# EAGLE design heart (EAGLE 9.6.2)
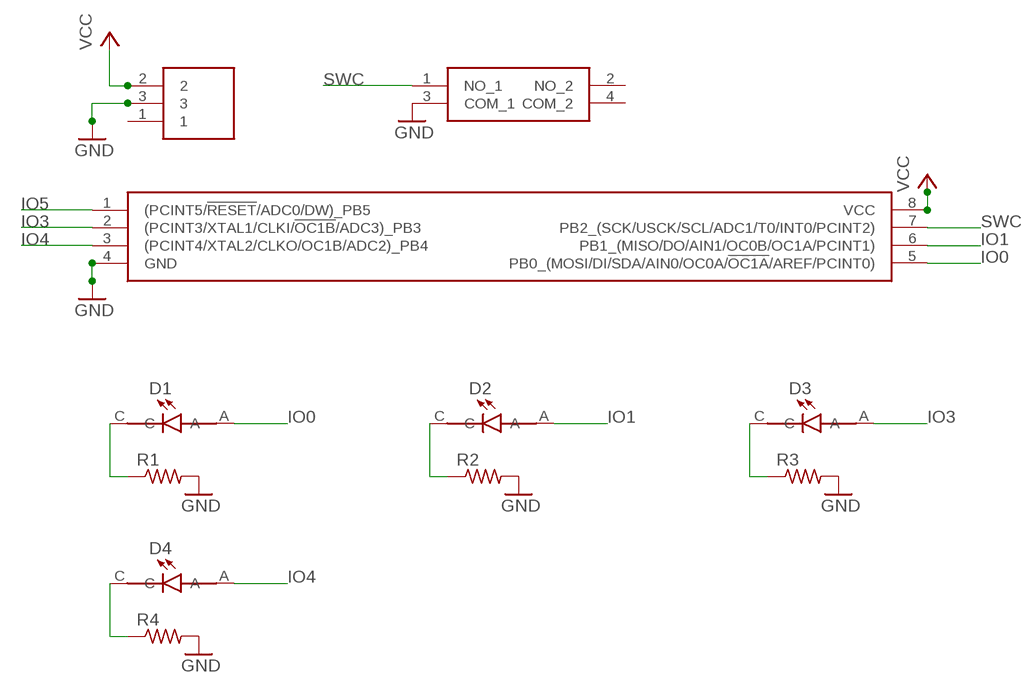
[diagram p0: schematic, sheet 1]

## Parts
D1  SML-LXT0805IW-TR  [LEDC2012X120N]
D2  SML-LXT0805IW-TR  [LEDC2012X120N]
D3  SML-LXT0805IW-TR  [LEDC2012X120N]
D4  SML-LXT0805IW-TR  [LEDC2012X120N]
IC1  ATTINY85-20SU  [SOIC127P798X216-8N]
R1  R-US_R0805  [R0805]
R2  R-US_R0805  [R0805]
R3  R-US_R0805  [R0805]
R4  R-US_R0805  [R0805]
S1  TS18-5-20-SL-160-SMT-TR  [TS18520SL160SMTTR]
U1  BAT-HLD-001  [BATHLD001]

## Nets
GND: IC1.4(GND) R1.2 R2.2 R3.2 R4.2 S1.3(COM_1) U1.3
IO0: D1.A IC1.5(PB0_(MOSI/DI/SDA/AIN0/OC0A/!OC1A!/AREF/PCINT0))
IO1: D2.A IC1.6(PB1_(MISO/DO/AIN1/OC0B/OC1A/PCINT1))
IO3: D3.A IC1.2((PCINT3/XTAL1/CLKI/!OC1B!/ADC3)_PB3)
IO4: D4.A IC1.3((PCINT4/XTAL2/CLKO/OC1B/ADC2)_PB4)
IO5: IC1.1((PCINT5/!RESET!/ADC0/DW)_PB5)
N$1: D1.C R1.1
N$2: D4.C R4.1
N$3: D2.C R2.1
N$5: D3.C R3.1
SWC: IC1.7(PB2_(SCK/USCK/SCL/ADC1/T0/INT0/PCINT2)) S1.1(NO_1)
VCC: IC1.8(VCC) U1.2
Unconnected: S1.2(NO_2) S1.4(COM_2) U1.1

## Library data of the parts
D1-D4 = SML-LXT0805IW-TR:SML-LXT0805IW-TR: LED; Luminous Intensity:11µcd; Viewing Angle:140°; Forward Current:30mA; Forward Voltage:2V; Color:Red; LED Color:Red; Leaded Process Compatible:Yes; Lens Color:White; Mounting Type:Surface Mount ;RoHS Compliant: Yes Check availability <https://pricing.snapeda.com/parts/SML-LXT0805IW-TR/Lumex%20Opto/Components/view-part?ref=eda>; AVAILABILITY: In Stock; DESCRIPTION: Red - LED Indication - Discrete 2V 0805 (2012 Metric); MF: Lumex Opto/Components; MP: SML-LXT0805IW-TR; PACKAGE: 0805 Lumex; PRICE: None; PURCHASE-URL: https://pricing.snapeda.com/search/part/SML-LXT0805IW-TR/?ref=eda
IC1 = ATTINY85-20SU:ATTINY85-20SU: MICROCHIP - ATTINY85-20SU - MICROCONTROLLER MCU, 8 BIT, ATTINY, 20MHZ, SOIC-8 Source: Datasheet <https://componentsearchengine.com/Datasheets/2/ATTINY85-20SU.pdf>; DESCRIPTION: MICROCHIP - ATTINY85-20SU - MICROCONTROLLER MCU, 8 BIT, ATTINY, 20MHZ, SOIC-8; HEIGHT: 2.16mm; MANUFACTURER_NAME: Microchip; MANUFACTURER_PART_NUMBER: ATTINY85-20SU; MOUSER_PART_NUMBER: 556-ATTINY85-20SU; MOUSER_PRICE-STOCK: https://www.mouser.co.uk/ProductDetail/Microchip-Technology-Atmel/ATTINY85-20SU?qs=8jWQYweyg6N%2FGXnwAe4Icw%3D%3D
R1-R4 = adafruit:R-US_: RESISTOR, American symbol
S1 = TS18-5-20-SL-160-SMT-TR:TS18-5-20-SL-160-SMT-TR: Tactile Switches 5 x 5 mm, 2 mm Actuator Height, 160 gf, Silver, Surface Mount, TR, SPST, Tactile Switch Source: Datasheet <https://www.cuidevices.com/product/resource/ts18.pdf>; DESCRIPTION: Tactile Switches 5 x 5 mm, 2 mm Actuator Height, 160 gf, Silver, Surface Mount, TR, SPST, Tactile Switch; HEIGHT: 2.2mm; MANUFACTURER_NAME: CUI Devices; MANUFACTURER_PART_NUMBER: TS18-5-20-SL-160-SMT-TR; MOUSER_PART_NUMBER: 179-TS18520SL160SMTT; MOUSER_PRICE-STOCK: https://www.mouser.co.uk/ProductDetail/CUI-Devices/TS18-5-20-SL-160-SMT-TR?qs=tlsG%2FOw5FFjSVAS9XMKu7w%3D%3D
U1 = BAT-HLD-001:BAT-HLD-001: Coin Cell Battery Holders Linx CR2032 Battery Holder Source: Datasheet; DESCRIPTION: Coin Cell Battery Holders Linx CR2032 Battery Holder; HEIGHT: 4mm; MANUFACTURER_NAME: Linx Technologies; MANUFACTURER_PART_NUMBER: BAT-HLD-001; MOUSER_PART_NUMBER: 712-BAT-HLD-001; MOUSER_PRICE-STOCK: https://www.mouser.co.uk/ProductDetail/Linx-Technologies/BAT-HLD-001?qs=K5ta8V%252BWhta7hbVGfm4dqA%3D%3D

## Board
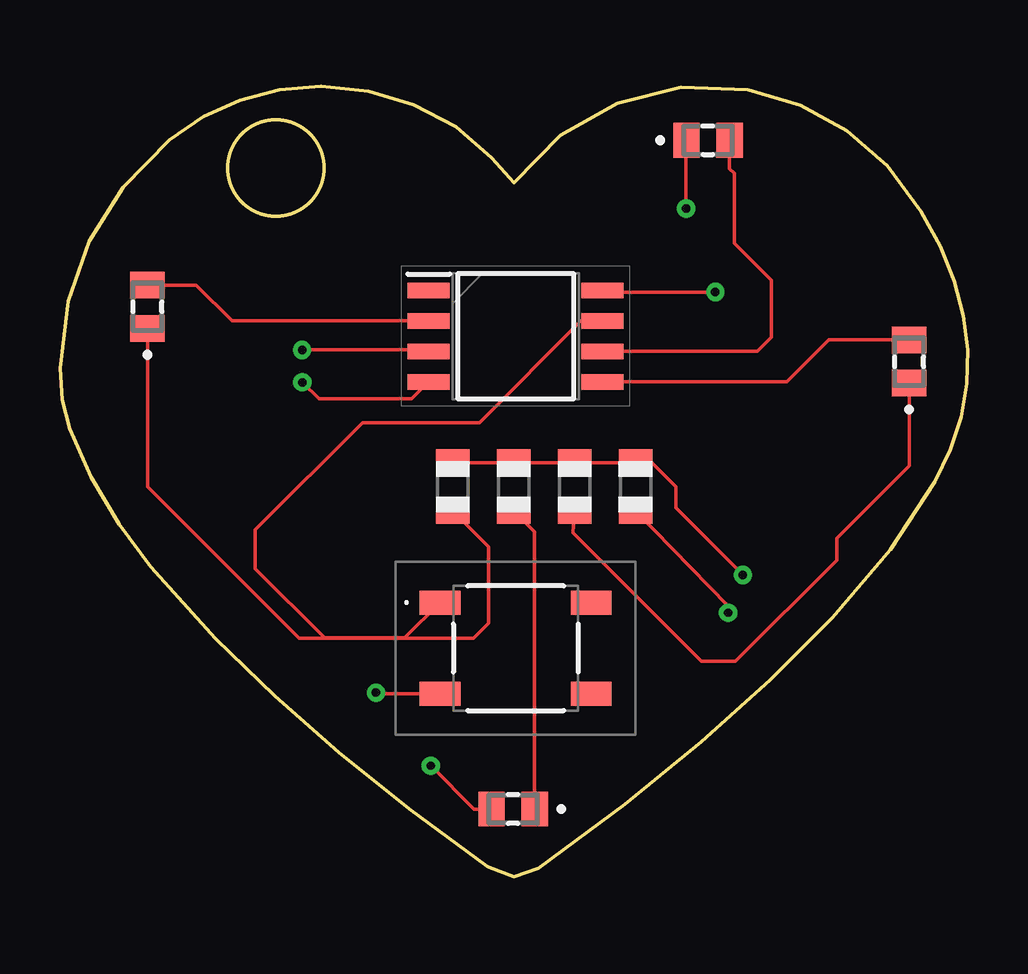
[diagram p1: board, top side]
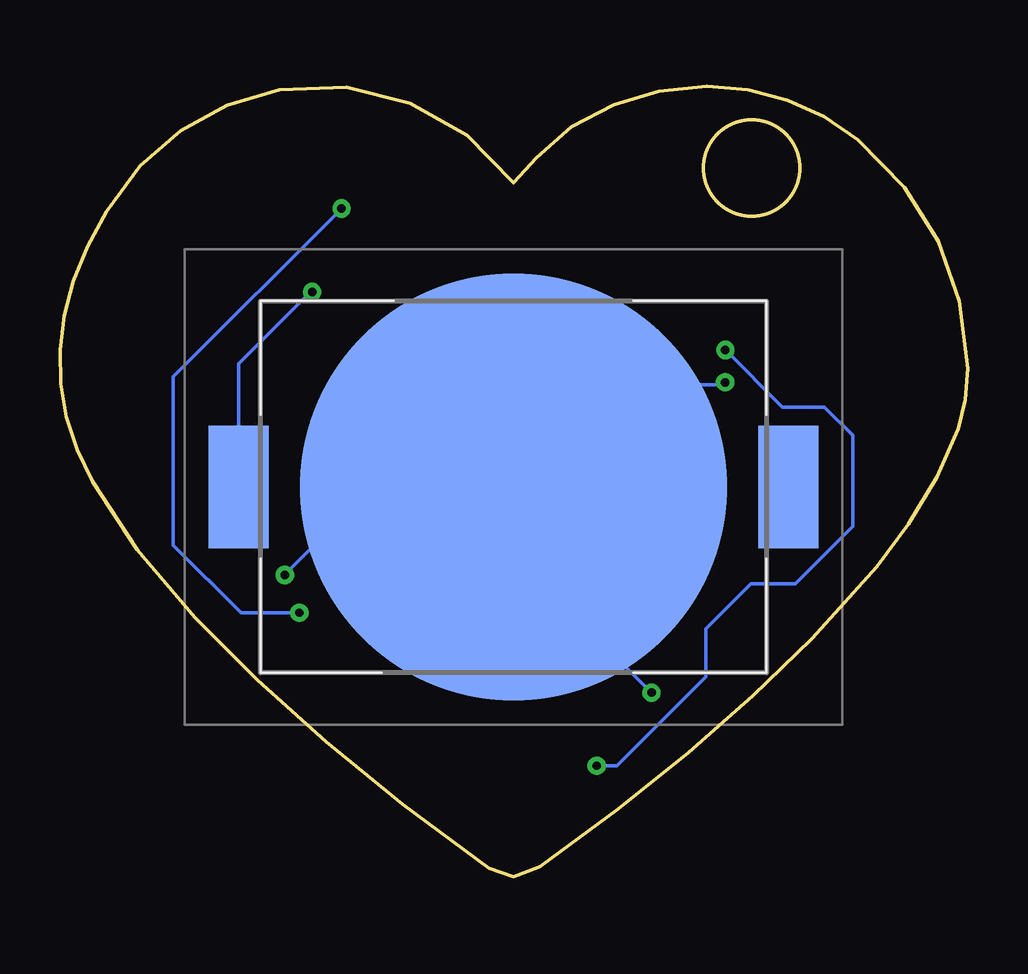
[diagram p2: board, bottom side, seen from below]

Size 37.84 x 32.92 mm. Coordinates in mm from the lower left corner, seen from the top.
Outline: 4.58,30.69 2.63,28.73 1.22,26.48 0.34,23.96 0,21.18 0.1,19.87 0.4,18.67 1.29,16.63 2.47,14.67 3.78,12.91 6.49,9.9 8.94,7.53 11.61,5.18 14.55,2.83 17.8,0.42 17.89,0.38 18.92,0 19.96,0.35 23.55,3.02 26.75,5.62 29.62,8.19 32.21,10.79 34.61,13.62 36.47,16.45 37.12,17.79 37.57,19.15 37.81,20.54 37.84,21.94 37.66,23.36 37.28,24.8 36.69,26.26 35.89,27.73 34.48,29.61 32.81,31.08 30.87,32.14 28.67,32.77 25.89,32.88 23.25,32.22 20.87,30.88 18.92,28.91 17.98,29.95 16.51,31.24 14.75,32.16 12.86,32.73 10.88,32.92 9.16,32.78 7.51,32.35 5.97,31.65 4.58,30.69
Outline: circle at 9,29.52 radius 2
Copper layers (1*16): Top 0.035mm / dielectric 1.5mm / Bottom 0.035mm
Design rules "default": minimum track width 6mil, minimum drill 0.35mm, track to track 6mil, track to pad 6mil, pad to pad 6mil, via to via 6mil, smd to smd 6mil, copper to edge 40mil, drill to drill 6mil, minimum pad ring 10mil, minimum via ring 8mil, stop-mask expansion 4mil, vias tented up to drill 0mil, thermal gap 10mil

### Footprints (pad centres in the part's own frame; a part is rotated, then mirrored left to right if it is on the bottom)
LEDC2012X120N = smd 1.1 x 1.45: A 0.9,0; C -0.9,0
SOIC127P798X216-8N = smd 1.75 x 0.65: 1 -3.625,1.905; 2 -3.625,0.635; 3 -3.625,-0.635; 4 -3.625,-1.905; 5 3.625,-1.905; 6 3.625,-0.635; 7 3.625,0.635; 8 3.625,1.905
R0805 = smd 1.1 x 1.4: 1 -1,0; 2 1,0
TS18520SL160SMTTR = smd 1.7 x 1: 1 -3.15,1.9; 2 3.15,1.9; 3 -3.15,-1.9; 4 3.15,-1.9
BATHLD001 = smd 2.5 x 5.1: 1 11.45,0; 2 -11.45,0 | smd 17.8 x 17.8: 3 0,0

### Placement (x,y rotation side)
D1  35.4,21.46 90 top
D2  27.02,30.68 0 top
D3  3.65,23.74 90 top
D4  18.89,2.81 180 top
IC1  19,22.52 0 top
R1  21.45,16.25 90 top
R2  23.99,16.25 90 top
R3  16.37,16.25 90 top
R4  18.91,16.25 90 top
S1  19,9.52 0 top
U1  18.93,16.23 0 bottom

### Tracks (layer width: path | path; a pad name or v marks a point on that pad's centre or on a via)
GND  (via drill 0.35)
  Top 0.152: 15.36,20.59 IC1.4 14.66,19.9 10.8,19.9 v10.1,20.59 | R3.2 16.42,17.25 R4.2 R1.2 R2.2 24.67,17.25 25.67,16.25 25.67,15.36 v28.46,12.57 | S1.3 13.22,7.62 v13.17,7.67
  Bottom 0.152: U1.3 17,16.23 12.75,20.49 10.21,20.49 v10.1,20.59 | v28.46,12.57 24.8,16.23 U1.3 | v13.17,7.67 18.93,13.42 U1.3
IO0
  Top 0.152: IC1.5 30.31,20.61 32.06,22.36 D1.A
IO1
  Top 0.152: IC1.6 29.07,21.88 29.66,22.47 29.66,24.84 28.11,26.39 28.11,29.31 27.92,29.5 D2.A
IO3
  Top 0.152: IC1.2 7.17,23.15 5.68,24.64 D3.A
IO4  (via drill 0.35)
  Top 0.152: v10.1,21.94 15.32,21.94 IC1.3 | D4.A 17.26,2.81 v15.46,4.62
  Bottom 0.152: v10.1,21.94 7.71,19.55 5.97,19.55 4.79,18.38 4.79,14.59 7.18,12.21 9.04,12.21 10.91,10.33 10.91,8.33 14.62,4.62 v15.46,4.62
IO5
  Top 0.152: 15.37,24.45 IC1.1
N$1
  Top 0.152: D1.C 35.4,17.11 32.38,14.09 32.38,13.19 28.16,8.96 26.74,8.96 21.38,14.32 R1.1
N$2
  Top 0.152: R4.1 19.79,14.38 D4.C
N$3  (via drill 0.35)
  Top 0.152: v26.1,27.83 26.1,30.66 D2.C | v27.85,10.99 27.85,11.29 R2.1
  Bottom 0.152: v27.85,10.99 30.29,10.99 33.11,13.81 33.11,20.82 v26.1,27.83
N$5
  Top 0.152: R3.1 17.87,13.75 17.87,10.56 17.24,9.93 9.96,9.93 3.65,16.24 D3.C
SWC
  Top 0.152: IC1.7 21.72,23.15 17.49,18.92 12.61,18.92 8.14,14.45 8.14,12.82 11.03,9.94 14.37,9.94 S1.1
VCC  (via drill 0.35)
  Top 0.152: IC1.8 22.69,24.35 v27.32,24.35
  Bottom 0.152: U1.2 30.38,21.37 27.36,24.39 v27.32,24.35